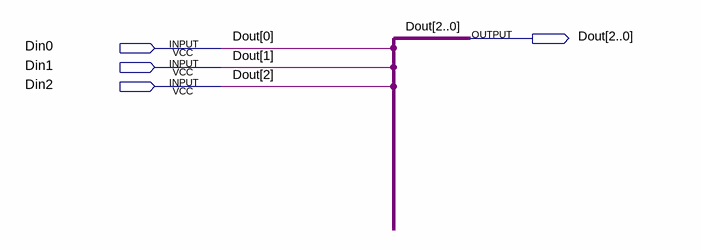
[diagram p0: schematic sheet]
// Quartus schematic cvt_1x3_3x1.bdf as structural Verilog: 0 symbols, 4 pins
module cvt_1x3_3x1 (
  input  Din0,
  input  Din1,
  input  Din2,
  output [2:0] Dout
);


  assign Dout = {Din2, Din1, Din0};
endmodule
